# EAGLE board Alcohol_Detector_Project_Schematic (EAGLE 9.6.2), part 1 of 2
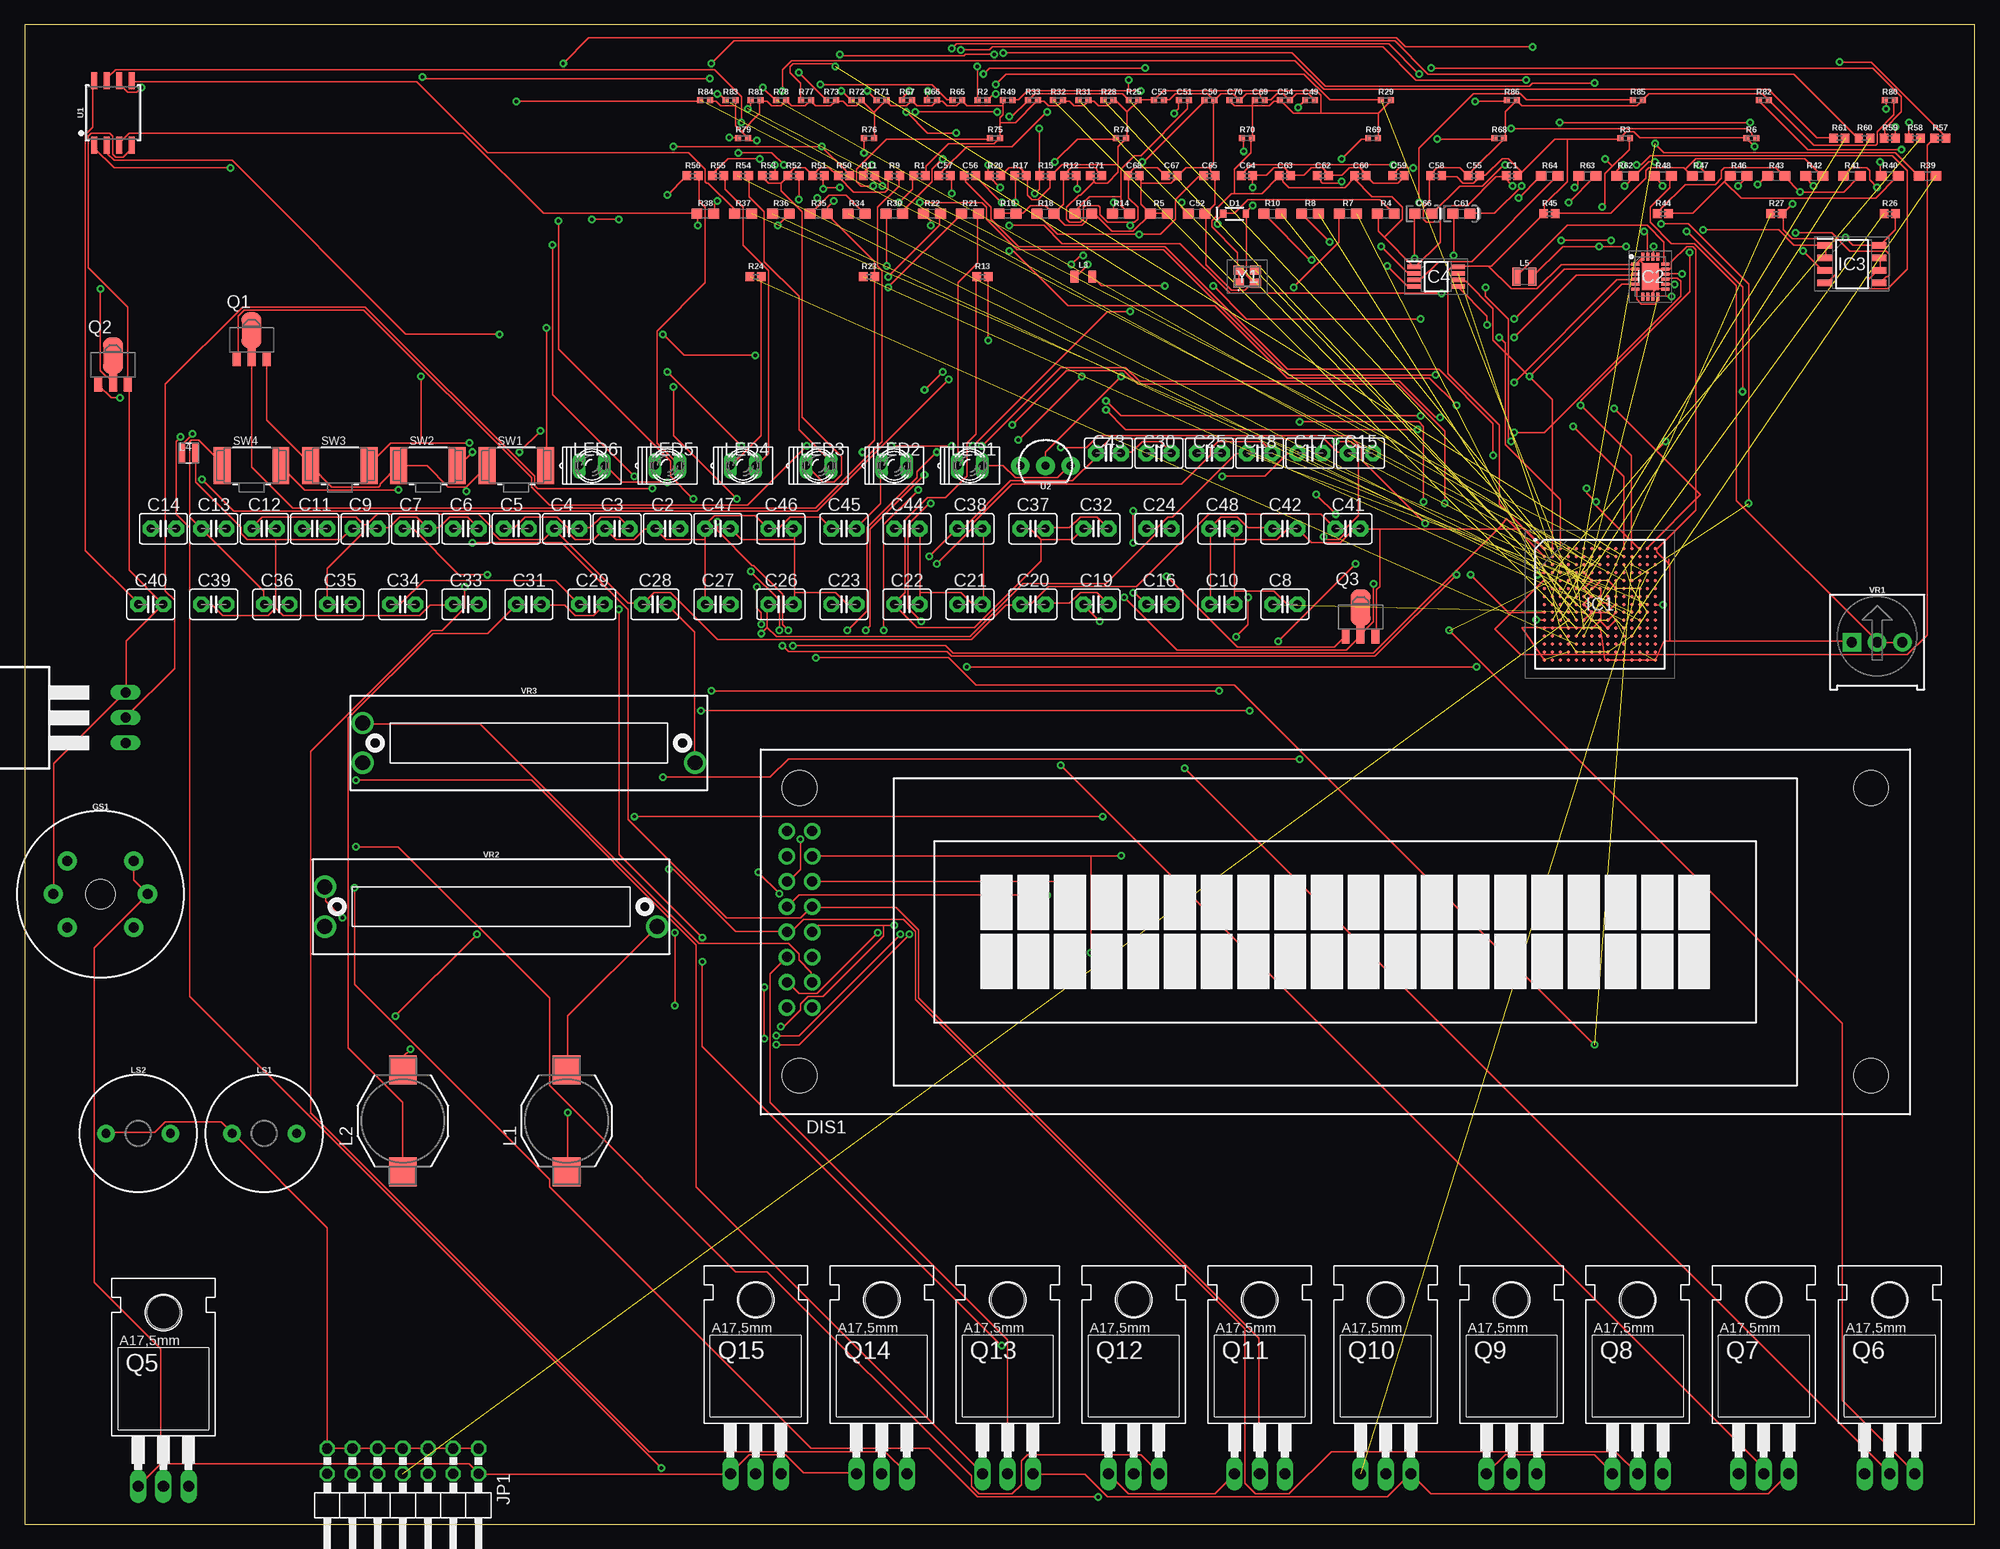
[diagram p7: board, top side]
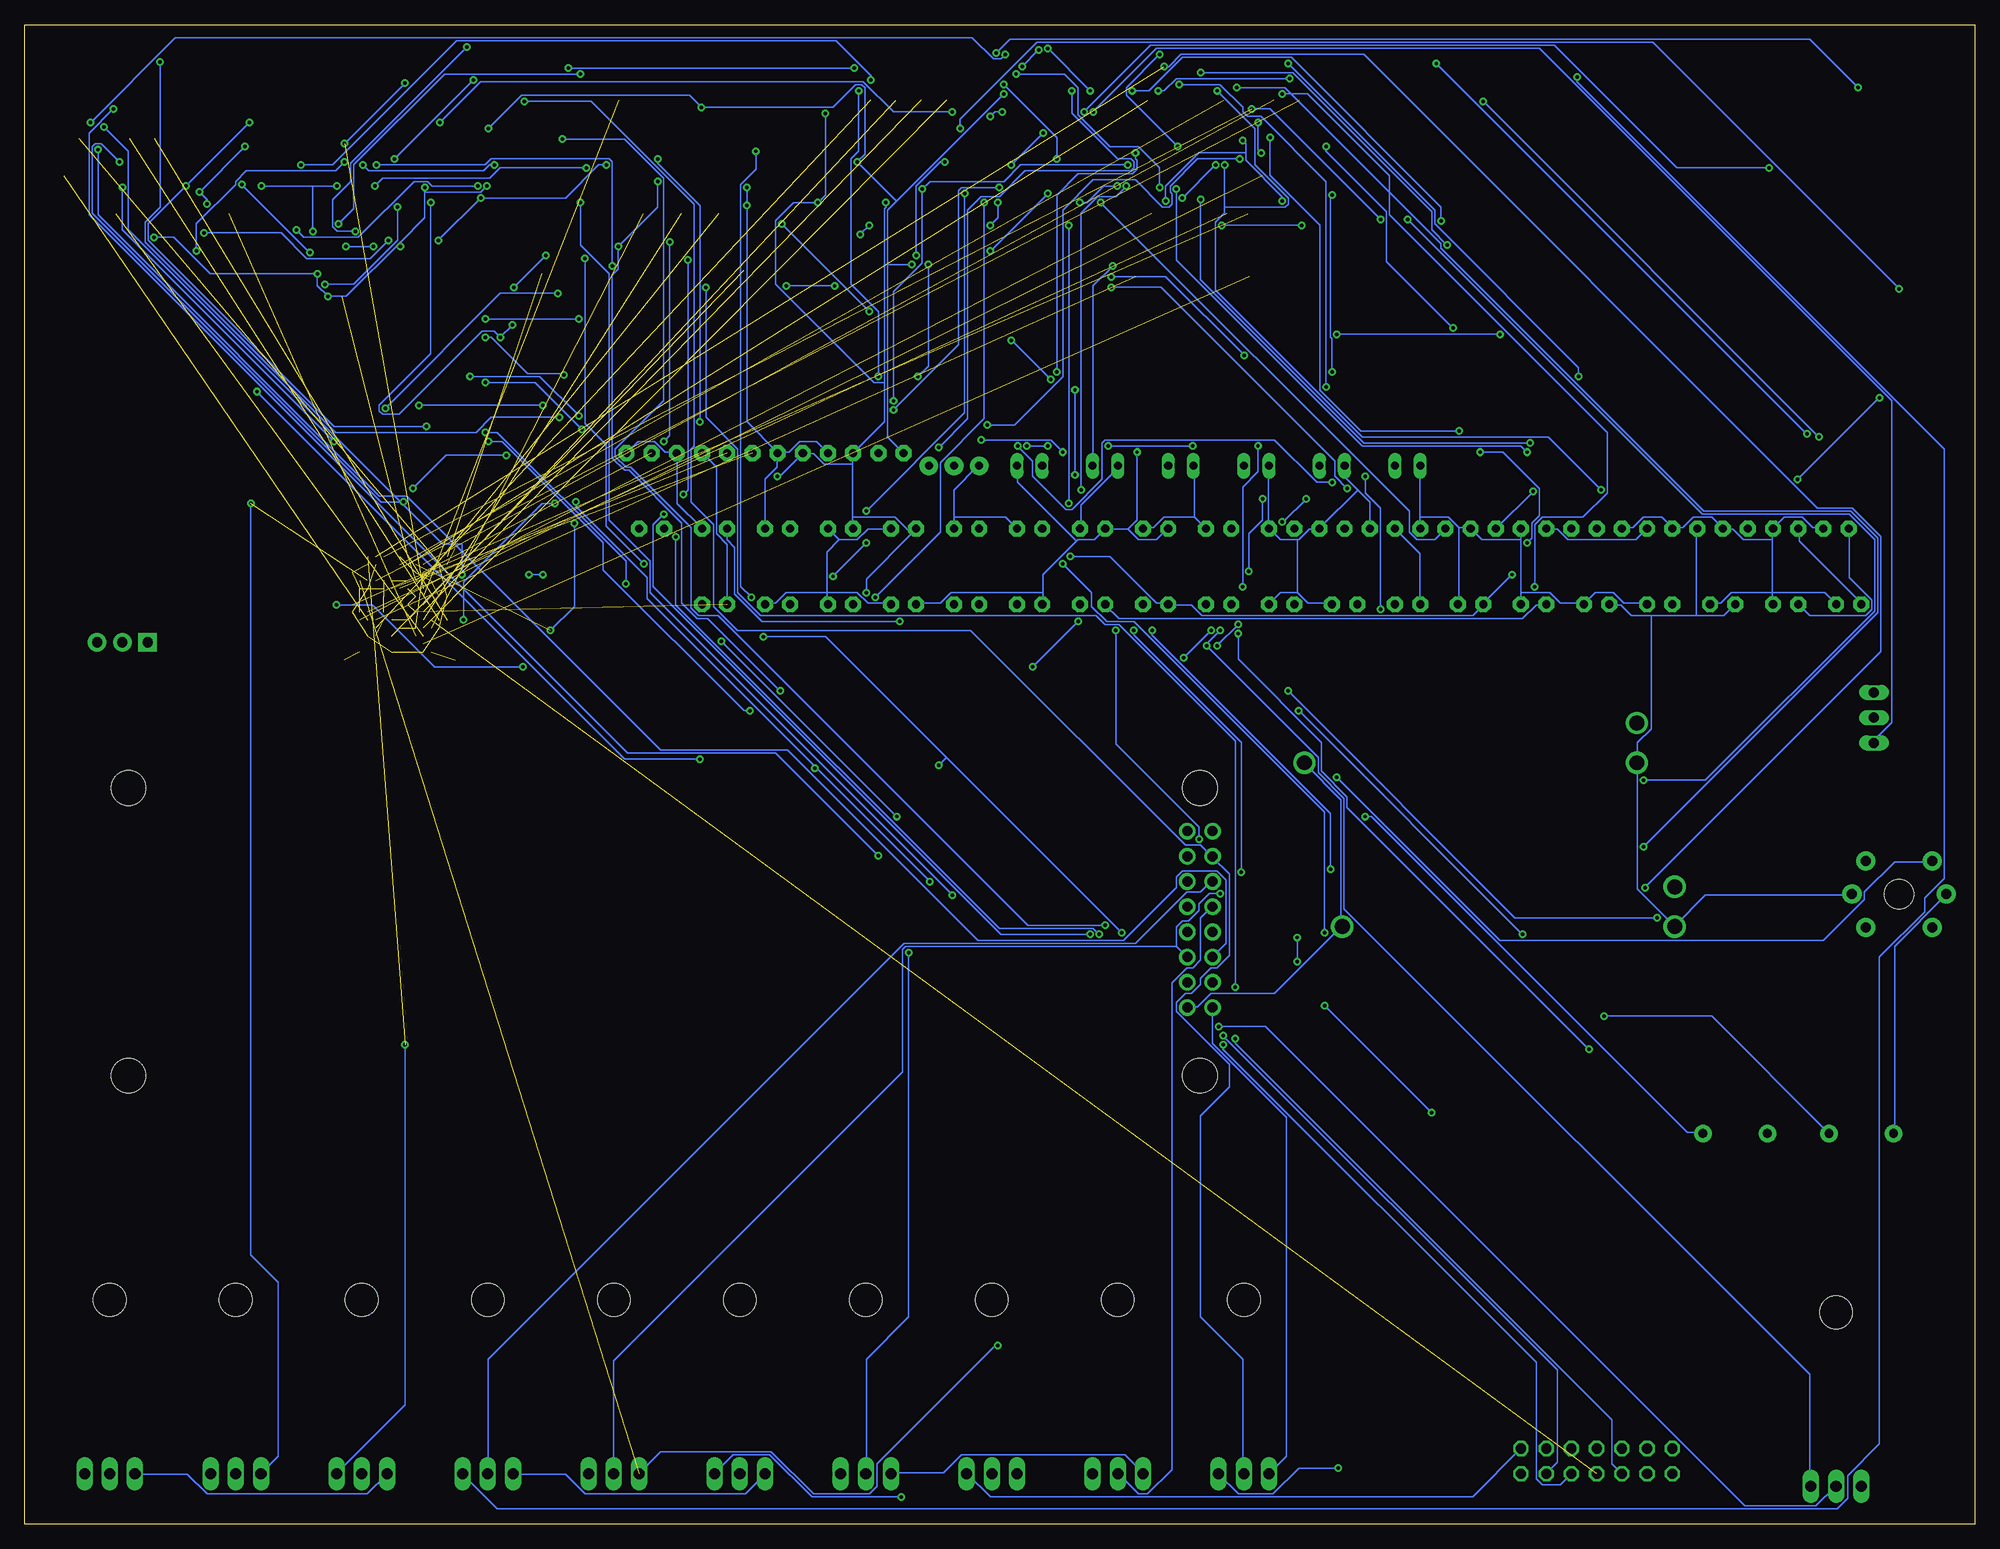
[diagram p8: board, bottom side, seen from below]

Size 196.52 x 151.12 mm. Coordinates in mm from the lower left corner, seen from the top.
Outline: 0,0 196.52,0 196.52,151.12 0,151.12 0,0
Copper layers ([6:[2:[4:[12:1+2*3+4*5+6*11+12*13+14*15+16]]]]): Top 0.035mm / dielectric 1.5mm / Route2 0.035mm / dielectric 0.15mm / Route3 0.035mm / dielectric 0.2mm / Route4 0.035mm / dielectric 0.15mm / Route5 0.035mm / dielectric 0.2mm / Route6 0.035mm / dielectric 0.15mm / Route11 0.035mm / dielectric 0.2mm / Route12 0.035mm / dielectric 0.15mm / Route13 0.035mm / dielectric 0.2mm / Route14 0.035mm / dielectric 0.15mm / Route15 0.035mm / dielectric 0.2mm / Bottom 0.035mm
Design rules "default *": minimum track width 6mil, minimum drill 0.35mm, track to track 6mil, track to pad 6mil, pad to pad 6mil, via to via 6mil, smd to smd 6mil, copper to edge 40mil, drill to drill 6mil, minimum pad ring 10mil, minimum via ring 8mil, stop-mask expansion 4mil, vias tented up to drill 0mil, thermal gap 10mil

## Footprints (pad centres in the part's own frame; a part is rotated, then mirrored left to right if it is on the bottom)
0402 = smd 0.85 x 0.9: 1 -0.58,0; 2 0.58,0
C2.5-3 = drill 0.813 pad 1.6 octagon: 1 -1.27,0; 2 1.27,0
0402-TIGHT = smd 0.6 x 0.6: 1 -0.5,0; 2 0.5,0
0603 = smd 1.1 x 1: 1 -0.85,0; 2 0.85,0
0603-POLAR = smd 1.1 x 1: + 0.85,0; - -0.85,0
SOD-323 = smd 0.63 x 0.83: A 1.15,0; C -1.15,0
TUXGR_20X2 = drill 1 pad 1.676: 1 -52.73,-7.62; 2 -55.27,-7.62; 3 -52.73,-5.08; 4 -55.27,-5.08; 5 -52.73,-2.54; 6 -55.27,-2.54; 7 -52.73,0; 8 -55.27,0; 9 -52.73,2.54; 10 -55.27,2.54; 11 -52.73,5.08; 12 -55.27,5.08; 13 -52.73,7.62; 14 -55.27,7.62; 15 -52.73,10.16; 16 -55.27,10.16 | hole 3.5: -54,-14.5; 54,-14.5; -54,14.5; 54,14.5
GAS_SENSOR = drill 1.016 pad 1.93: A1 -3.35,3.35; A2 -3.35,-3.35; B1 3.35,3.35; B2 3.35,-3.35; HA -4.75,0; HB 4.75,0 | hole 3: 0,0
BGA225C80P15X15_1300X1300X140 = smd 0.37 x 0.37: A1 -5.6,5.6; A2 -4.8,5.6; A3 -4,5.6; A4 -3.2,5.6; A5 -2.4,5.6; A6 -1.6,5.6; A7 -0.8,5.6; A8 0,5.6; A9 0.8,5.6; A10 1.6,5.6; A11 2.4,5.6; A12 3.2,5.6; A13 4,5.6; A14 4.8,5.6; A15 5.6,5.6; B1 -5.6,4.8; B2 -4.8,4.8; B3 -4,4.8; B4 -3.2,4.8; B5 -2.4,4.8; B6 -1.6,4.8; B7 -0.8,4.8; B8 0,4.8; B9 0.8,4.8; B10 1.6,4.8; B11 2.4,4.8; B12 3.2,4.8; B13 4,4.8; B14 4.8,4.8; B15 5.6,4.8; C1 -5.6,4; C2 -4.8,4; C3 -4,4; C4 -3.2,4; C5 -2.4,4; C6 -1.6,4; C7 -0.8,4; C8 0,4; C9 0.8,4; C10 1.6,4; C11 2.4,4; C12 3.2,4; C13 4,4; C14 4.8,4; C15 5.6,4; D1 -5.6,3.2; D2 -4.8,3.2; D3 -4,3.2; D4 -3.2,3.2; D5 -2.4,3.2; D6 -1.6,3.2; D7 -0.8,3.2; D8 0,3.2; D9 0.8,3.2; D10 1.6,3.2; D11 2.4,3.2; D12 3.2,3.2; D13 4,3.2; D14 4.8,3.2; D15 5.6,3.2; E1 -5.6,2.4; E2 -4.8,2.4; E3 -4,2.4; E4 -3.2,2.4; E5 -2.4,2.4; E6 -1.6,2.4; E7 -0.8,2.4; E8 0,2.4; E9 0.8,2.4; E10 1.6,2.4; E11 2.4,2.4; E12 3.2,2.4; E13 4,2.4; E14 4.8,2.4; E15 5.6,2.4; F1 -5.6,1.6; F2 -4.8,1.6; F3 -4,1.6; F4 -3.2,1.6; F5 -2.4,1.6; F6 -1.6,1.6; F7 -0.8,1.6; F8 0,1.6; F9 0.8,1.6; F10 1.6,1.6; F11 2.4,1.6; F12 3.2,1.6; F13 4,1.6; F14 4.8,1.6; F15 5.6,1.6; G1 -5.6,0.8; G2 -4.8,0.8; G3 -4,0.8; G4 -3.2,0.8; G5 -2.4,0.8; G6 -1.6,0.8; G7 -0.8,0.8; G8 0,0.8; G9 0.8,0.8; G10 1.6,0.8; G11 2.4,0.8; G12 3.2,0.8; G13 4,0.8; G14 4.8,0.8; G15 5.6,0.8; H1 -5.6,0; H2 -4.8,0; H3 -4,0; H4 -3.2,0; H5 -2.4,0; H6 -1.6,0; H7 -0.8,0; H8 0,0; H9 0.8,0; H10 1.6,0; H11 2.4,0; H12 3.2,0; H13 4,0; H14 4.8,0; H15 5.6,0; J1 -5.6,-0.8; J2 -4.8,-0.8; J3 -4,-0.8; J4 -3.2,-0.8; J5 -2.4,-0.8; J6 -1.6,-0.8; J7 -0.8,-0.8; J8 0,-0.8; J9 0.8,-0.8; J10 1.6,-0.8; J11 2.4,-0.8; J12 3.2,-0.8; J13 4,-0.8; J14 4.8,-0.8; J15 5.6,-0.8; K1 -5.6,-1.6; K2 -4.8,-1.6; K3 -4,-1.6; K4 -3.2,-1.6; K5 -2.4,-1.6; K6 -1.6,-1.6; K7 -0.8,-1.6; K8 0,-1.6; K9 0.8,-1.6; K10 1.6,-1.6; K11 2.4,-1.6; K12 3.2,-1.6; K13 4,-1.6; K14 4.8,-1.6; K15 5.6,-1.6; L1 -5.6,-2.4; L2 -4.8,-2.4; L3 -4,-2.4; L4 -3.2,-2.4; L5 -2.4,-2.4; L6 -1.6,-2.4; L7 -0.8,-2.4; L8 0,-2.4; L9 0.8,-2.4; L10 1.6,-2.4; L11 2.4,-2.4; L12 3.2,-2.4; L13 4,-2.4; L14 4.8,-2.4; L15 5.6,-2.4; M1 -5.6,-3.2; M2 -4.8,-3.2; M3 -4,-3.2; M4 -3.2,-3.2; M5 -2.4,-3.2; M6 -1.6,-3.2; M7 -0.8,-3.2; M8 0,-3.2; M9 0.8,-3.2; M10 1.6,-3.2; M11 2.4,-3.2; M12 3.2,-3.2; M13 4,-3.2; M14 4.8,-3.2; M15 5.6,-3.2; N1 -5.6,-4; N2 -4.8,-4; N3 -4,-4; N4 -3.2,-4; N5 -2.4,-4; N6 -1.6,-4; N7 -0.8,-4; N8 0,-4; N9 0.8,-4; N10 1.6,-4; N11 2.4,-4; N12 3.2,-4; N13 4,-4; N14 4.8,-4; N15 5.6,-4; P1 -5.6,-4.8; P2 -4.8,-4.8; P3 -4,-4.8; P4 -3.2,-4.8; P5 -2.4,-4.8; P6 -1.6,-4.8; P7 -0.8,-4.8; P8 0,-4.8; P9 0.8,-4.8; P10 1.6,-4.8; P11 2.4,-4.8; P12 3.2,-4.8; P13 4,-4.8; P14 4.8,-4.8; P15 5.6,-4.8; R1 -5.6,-5.6; R2 -4.8,-5.6; R3 -4,-5.6; R4 -3.2,-5.6; R5 -2.4,-5.6; R6 -1.6,-5.6; R7 -0.8,-5.6; R8 0,-5.6; R9 0.8,-5.6; R10 1.6,-5.6; R11 2.4,-5.6; R12 3.2,-5.6; R13 4,-5.6; R14 4.8,-5.6; R15 5.6,-5.6
QFN50P300X400X80-21N = smd 0.8 x 0.3: 1 -1.5,1.25; 2 -1.5,0.75; 3 -1.5,0.25; 4 -1.5,-0.25; 5 -1.5,-0.75; 6 -1.5,-1.25; 11 1.5,-1.25; 12 1.5,-0.75; 13 1.5,-0.25; 14 1.5,0.25; 15 1.5,0.75; 16 1.5,1.25 | smd 0.3 x 0.8: 7 -0.75,-2; 8 -0.25,-2; 9 0.25,-2; 10 0.75,-2; 17 0.75,2; 18 0.25,2; 19 -0.25,2; 20 -0.75,2 | smd 1.75 x 2.75: 21 0,0
SOIC127P600X175-8N = smd 1.528 x 0.65: 1 -2.711,1.905; 2 -2.711,0.635; 3 -2.711,-0.635; 4 -2.711,-1.905; 5 2.711,-1.905; 6 2.711,-0.635; 7 2.711,0.635; 8 2.711,1.905
SOP65P490X110-8N = smd 1.4 x 0.45: 1 -2.2,0.975; 2 -2.2,0.325; 3 -2.2,-0.325; 4 -2.2,-0.975; 5 2.2,-0.975; 6 2.2,-0.325; 7 2.2,0.325; 8 2.2,0.975
2X07/90 = drill 1.016 octagon: 1 -7.62,-6.35; 2 -7.62,-3.81; 3 -5.08,-6.35; 4 -5.08,-3.81; 5 -2.54,-6.35; 6 -2.54,-3.81; 7 0,-6.35; 8 0,-3.81; 9 2.54,-6.35; 10 2.54,-3.81; 11 5.08,-6.35; 12 5.08,-3.81; 13 7.62,-6.35; 14 7.62,-3.81
P0762NL = smd 2.794 x 2.921: 1 0,5.156; 2 0,-5.156
0805 = smd 0.8 x 1.2: 1 -0.9,0; 2 0.9,0
INDUCTOR_2X2 = smd 0.65 x 2: P$1 -0.675,0; P$2 0.675,0
0805-WIDE = smd 0.8 x 1.8: 1 -0.8,0; 2 0.8,0
Q62902-B152 = drill 0.813 long: A 1.27,0; K -1.27,0
BUZZER-12MM = drill 0.9 pad 1.778: + 3.25,0; - -3.25,0
SOT89 = smd 0.8 x 1.4: 1 -1.499,-1.981; 3 1.499,-1.981 | smd 0.8 x 1.9: 2 0,-1.727 | smd 2.032 x 3.65: 2@1 0,0.94
TO262-H = drill 1.016 long: 1 -2.54,-12.7; 2 0,-12.7; 3 2.54,-12.7
TO220AH = drill 1.118 long: B -2.54,-6.35; C 0,-6.35; E 2.54,-6.35 | hole 3.302: 0,11.176
BTN_CK_KSS = smd 1.7 x 3.7: P$1 -2.95,0; P$2 2.95,0
SOIC-8 = smd 0.61 x 1.702: 1 -1.905,-3.251; 2 -0.635,-3.251; 3 0.635,-3.251; 4 1.905,-3.251; 5 1.905,3.251; 6 0.635,3.251; 7 -0.635,3.251; 8 -1.905,3.251
TO-92-AMMO = drill 0.813 pad 1.88: 1 -2.54,0; 2 0,0; 3 2.54,0
TRIMPOT-PTH-3386U = drill 1.016 pad 1.88 square: 1 -2.54,-0.015 | drill 1.016 pad 1.88: 2 0,-0.015; 3 2.54,-0.015
SLIDER-SMALL = drill 1.5: BOTTOM 16.75,-2; TOP -16.75,-2; WIPER -16.75,2
SG210STF120000ML3 = smd 1.1 x 0.9: 1 -0.85,-0.65; 2 0.85,-0.65; 3 0.85,0.65; 4 -0.85,0.65

## Placement (x,y rotation side)
C1  0.1uF  [0402]  149.86,135.89 0 top
C2  47nf  [C2.5-3]  64.77,100.33 0 top
C3  47nf  [C2.5-3]  59.69,100.33 0 top
C4  47nf  [C2.5-3]  54.61,100.33 0 top
C5  47nf  [C2.5-3]  49.53,100.33 0 top
C6  47nf  [C2.5-3]  44.45,100.33 0 top
C7  47nf  [C2.5-3]  39.37,100.33 0 top
C8  470nf  [C2.5-3]  127,92.71 0 top
C9  47nf  [C2.5-3]  34.29,100.33 0 top
C10  470nf  [C2.5-3]  120.65,92.71 0 top
C11  47nf  [C2.5-3]  29.21,100.33 0 top
C12  47nf  [C2.5-3]  24.13,100.33 0 top
C13  47nf  [C2.5-3]  19.05,100.33 0 top
C14  47nf  [C2.5-3]  13.97,100.33 0 top
C15  47nf  [C2.5-3]  134.62,107.95 0 top
C16  470nf  [C2.5-3]  114.3,92.71 0 top
C17  47nf  [C2.5-3]  129.54,107.95 0 top
C18  10nf  [C2.5-3]  124.46,107.95 0 top
C19  470nf  [C2.5-3]  107.95,92.71 0 top
C20  470nf  [C2.5-3]  101.6,92.71 0 top
C21  470nf  [C2.5-3]  95.25,92.71 0 top
C22  470nf  [C2.5-3]  88.9,92.71 0 top
C23  470nf  [C2.5-3]  82.55,92.71 0 top
C24  4.7uf  [C2.5-3]  114.3,100.33 0 top
C25  47nf  [C2.5-3]  119.38,107.95 0 top
C26  470nf  [C2.5-3]  76.2,92.71 0 top
C27  470nf  [C2.5-3]  69.85,92.71 0 top
C28  470nf  [C2.5-3]  63.5,92.71 0 top
C29  470nf  [C2.5-3]  57.15,92.71 0 top
C30  47uf  [C2.5-3]  114.3,107.95 0 top
C31  470nf  [C2.5-3]  50.8,92.71 0 top
C32  4.7uf  [C2.5-3]  107.95,100.33 0 top
C33  470nf  [C2.5-3]  44.45,92.71 0 top
C34  470nf  [C2.5-3]  38.1,92.71 0 top
C35  470nf  [C2.5-3]  31.75,92.71 0 top
C36  470nf  [C2.5-3]  25.4,92.71 0 top
C37  4.7uf  [C2.5-3]  101.6,100.33 0 top
C38  4.7uf  [C2.5-3]  95.25,100.33 0 top
C39  100uf  [C2.5-3]  19.05,92.71 0 top
C40  470nf  [C2.5-3]  12.7,92.71 0 top
C41  470nf  [C2.5-3]  133.35,100.33 0 top
C42  470nf  [C2.5-3]  127,100.33 0 top
C43  47uf  [C2.5-3]  109.22,107.95 0 top
C44  4.7uf  [C2.5-3]  88.9,100.33 0 top
C45  4.7uf  [C2.5-3]  82.55,100.33 0 top
C46  4.7uf  [C2.5-3]  76.2,100.33 0 top
C47  4.7uf  [C2.5-3]  69.85,100.33 0 top
C48  100uf  [C2.5-3]  120.65,100.33 0 top
C49  10uF  [0402-TIGHT]  129.54,143.51 0 top
C50  20pF  [0402-TIGHT]  119.38,143.51 0 top
C51  20pF  [0402-TIGHT]  116.84,143.51 0 top
C52  22uF  [0603]  118.11,132.08 0 top
C53  20pF  [0402-TIGHT]  114.3,143.51 0 top
C54  10uF  [0402-TIGHT]  127,143.51 0 top
C55  0.1uF  [0402]  146.05,135.89 0 top
C56  1nF  [0402]  95.25,135.89 0 top
C57  1nF  [0402]  92.71,135.89 0 top
C58  1.0uF  [0402]  142.24,135.89 0 top
C59  0.1uF  [0402]  138.43,135.89 0 top
C60  0.1uF  [0402]  134.62,135.89 0 top
C61  10uF  [0603-POLAR]  144.78,132.08 0 top
C62  1.0uF  [0402]  130.81,135.89 0 top
C63  1.0uF  [0402]  127,135.89 0 top
C64  0.1uF  [0402]  123.19,135.89 0 top
C65  0.1uF  [0402]  119.38,135.89 0 top
C66  10uF  [0603-POLAR]  140.97,132.08 0 top
C67  0.1uF  [0402]  115.57,135.89 0 top
C68  0.1uF  [0402]  111.76,135.89 0 top
C69  10uF  [0402-TIGHT]  124.46,143.51 0 top
C70  10uF  [0402-TIGHT]  121.92,143.51 0 top
C71  1.0uF  [0402]  107.95,135.89 0 top
D1  3.6V  [SOD-323]  121.92,132.08 0 top
DIS1  TUXGR_20X2  [TUXGR_20X2]  132.08,59.69 0 top
GS1  GAS_SENSORMQ-3  [GAS_SENSOR]  7.62,63.5 0 top
IC1  XC7S25-1CSGA225I  [BGA225C80P15X15_1300X1300X140]  158.75,92.71 0 top
IC2  LTC3569EUDC#TRPBF  [QFN50P300X400X80-21N]  163.83,125.73 0 top
IC3  LMP7702MAX_NOPB  [SOIC127P600X175-8N]  184.15,127 0 top
IC4  DAC8532IDGKR  [SOP65P490X110-8N]  142.24,125.73 0 top
JP1  [2X07/90]  38.1,1.27 180 top
L1  P0762.154NL  [P0762NL]  54.61,40.64 0 top
L2  P0762.154NL  [P0762NL]  38.1,40.64 0 top
L3  3.3µH/±20%/450mA  [0805]  106.68,125.73 0 top
L4  1.5uH  [INDUCTOR_2X2]  16.51,107.95 0 top
L5  2.2uH  [0805-WIDE]  151.13,125.73 0 top
LED1  [Q62902-B152]  95.25,106.68 0 top
LED2  [Q62902-B152]  87.63,106.68 0 top
LED3  [Q62902-B152]  80.01,106.68 0 top
LED4  [Q62902-B152]  72.39,106.68 0 top
LED5  [Q62902-B152]  64.77,106.68 0 top
LED6  [Q62902-B152]  57.15,106.68 0 top
LS1  BUZZER-PTH  [BUZZER-12MM]  24.13,39.37 0 top
LS2  BUZZER-PTH  [BUZZER-12MM]  11.43,39.37 0 top
Q1  PNP-TRANSISTIOR-2COLSOT89  [SOT89]  22.86,119.38 0 top
Q2  [SOT89]  8.89,116.84 0 top
Q3  [SOT89]  134.62,91.44 0 top
Q4  IRF3704L  [TO262-H]  -2.54,81.28 90 top
Q5  IRF3704  [TO220AH]  13.97,10.16 0 top
Q6  IRF3704  [TO220AH]  187.96,11.43 0 top
Q7  IRF3704  [TO220AH]  175.26,11.43 0 top
Q8  IRF3704  [TO220AH]  162.56,11.43 0 top
Q9  IRF3704  [TO220AH]  149.86,11.43 0 top
Q10  IRF3704  [TO220AH]  137.16,11.43 0 top
Q11  IRF3704  [TO220AH]  124.46,11.43 0 top
Q12  IRF3704  [TO220AH]  111.76,11.43 0 top
Q13  IRF3704  [TO220AH]  99.06,11.43 0 top
Q14  IRF3704  [TO220AH]  86.36,11.43 0 top
Q15  IRF3704  [TO220AH]  73.66,11.43 0 top
R1  0  [0402]  90.17,135.89 0 top
R2  10k  [0402-TIGHT]  96.52,143.51 0 top
R3  3.3KOHM-0402T-1/16W-1%  [0402-TIGHT]  161.29,139.7 0 top
R4  120OHM  [0603]  137.16,132.08 0 top
R5  124k  [0603]  114.3,132.08 0 top
R6  150KOHM-0402T-1/16W-1%  [0402-TIGHT]  173.99,139.7 0 top
R7  120OHM  [0603]  133.35,132.08 0 top
R8  120OHM  [0603]  129.54,132.08 0 top
R9  22Ω  [0402]  87.63,135.89 0 top
R10  120OHM  [0603]  125.73,132.08 0 top
R11  0  [0402]  85.09,135.89 0 top
R12  100K  [0402]  105.41,135.89 0 top
R13  1KOHM-0402-1/16W-1%  [0402]  96.52,125.73 0 top
R14  30.1k  [0603]  110.49,132.08 0 top
R15  100K  [0402]  102.87,135.89 0 top
R16  124k  [0603]  106.68,132.08 0 top
R17  100K  [0402]  100.33,135.89 0 top
R18  180k  [0603]  102.87,132.08 0 top
R19  57.6k  [0603]  99.06,132.08 0 top
R20  100K  [0402]  97.79,135.89 0 top
R21  680  [0603]  95.25,132.08 0 top
R22  100  [0603]  91.44,132.08 0 top
R23  1KOHM-0402-1/16W-1%  [0402]  85.09,125.73 0 top
R24  1KOHM-0402-1/16W-1%  [0402]  73.66,125.73 0 top
R25  4.7k  [0402-TIGHT]  111.76,143.51 0 top
R26  1KOHM-0402-1/16W-1%  [0402]  187.96,132.08 0 top
R27  1KOHM-0402-1/16W-1%  [0402]  176.53,132.08 0 top
R28  4.7k  [0402-TIGHT]  109.22,143.51 0 top
R29  200OHM-0402T-1/16W-1%  [0402-TIGHT]  137.16,143.51 0 top
R30  100  [0603]  87.63,132.08 0 top
R31  4.7k  [0402-TIGHT]  106.68,143.51 0 top
R32  4.7k  [0402-TIGHT]  104.14,143.51 0 top
R33  4.7k  [0402-TIGHT]  101.6,143.51 0 top
R34  100  [0603]  83.82,132.08 0 top
R35  1.8k  [0603]  80.01,132.08 0 top
R36  100  [0603]  76.2,132.08 0 top
R37  100  [0603]  72.39,132.08 0 top
R38  1.8k  [0603]  68.58,132.08 0 top
R39  47  [0603]  191.77,135.89 0 top
R40  150  [0603]  187.96,135.89 0 top
R41  866  [0603]  184.15,135.89 0 top
R42  150  [0603]  180.34,135.89 0 top
R43  866  [0603]  176.53,135.89 0 top
R44  1KOHM-0402-1/16W-1%  [0402]  165.1,132.08 0 top
R45  1KOHM-0402-1/16W-1%  [0402]  153.67,132.08 0 top
R46  2.2  [0603]  172.72,135.89 0 top
R47  2.2  [0603]  168.91,135.89 0 top
R48  47  [0603]  165.1,135.89 0 top
R49  4.7k  [0402-TIGHT]  99.06,143.51 0 top
R50  10k  [0402]  82.55,135.89 0 top
R51  10k  [0402]  80.01,135.89 0 top
R52  10k  [0402]  77.47,135.89 0 top
R53  10k  [0402]  74.93,135.89 0 top
R54  330  [0402]  72.39,135.89 0 top
R55  330  [0402]  69.85,135.89 0 top
R56  330  [0402]  67.31,135.89 0 top
R57  330  [0402]  193.04,139.7 0 top
R58  10k  [0402]  190.5,139.7 0 top
R59  10k  [0402]  187.96,139.7 0 top
R60  10k  [0402]  185.42,139.7 0 top
R61  10k  [0402]  182.88,139.7 0 top
R62  150  [0603]  161.29,135.89 0 top
R63  100  [0603]  157.48,135.89 0 top
R64  150  [0603]  153.67,135.89 0 top
R65  22k  [0402-TIGHT]  93.98,143.51 0 top
R66  22k  [0402-TIGHT]  91.44,143.51 0 top
R67  33k  [0402-TIGHT]  88.9,143.51 0 top
R68  3.3KOHM-0402T-1/16W-1%  [0402-TIGHT]  148.59,139.7 0 top
R69  3.3KOHM-0402T-1/16W-1%  [0402-TIGHT]  135.89,139.7 0 top
R70  3.3KOHM-0402T-1/16W-1%  [0402-TIGHT]  123.19,139.7 0 top
R71  22k  [0402-TIGHT]  86.36,143.51 0 top
R72  22k  [0402-TIGHT]  83.82,143.51 0 top
R73  33k  [0402-TIGHT]  81.28,143.51 0 top
R74  3.3KOHM-0402T-1/16W-1%  [0402-TIGHT]  110.49,139.7 0 top
R75  3.3KOHM-0402T-1/16W-1%  [0402-TIGHT]  97.79,139.7 0 top
R76  3.3KOHM-0402T-1/16W-1%  [0402-TIGHT]  85.09,139.7 0 top
R77  22k  [0402-TIGHT]  78.74,143.51 0 top
R78  22k  [0402-TIGHT]  76.2,143.51 0 top
R79  3.3KOHM-0402T-1/16W-1%  [0402-TIGHT]  72.39,139.7 0 top
R80  3.3KOHM-0402T-1/16W-1%  [0402-TIGHT]  187.96,143.51 0 top
R81  33k  [0402-TIGHT]  73.66,143.51 0 top
R82  3.3KOHM-0402T-1/16W-1%  [0402-TIGHT]  175.26,143.51 0 top
R83  22k  [0402-TIGHT]  71.12,143.51 0 top
R84  22k  [0402-TIGHT]  68.58,143.51 0 top
R85  3.3KOHM-0402T-1/16W-1%  [0402-TIGHT]  162.56,143.51 0 top
R86  3.3KOHM-0402T-1/16W-1%  [0402-TIGHT]  149.86,143.51 0 top
SW1  [BTN_CK_KSS]  49.53,106.68 0 top
SW2  [BTN_CK_KSS]  40.64,106.68 0 top
SW3  [BTN_CK_KSS]  31.75,106.68 0 top
SW4  [BTN_CK_KSS]  22.86,106.68 0 top
U1  W25Q32FV  [SOIC-8]  8.89,142.24 0 top
U2  DS18B20  [TO-92-AMMO]  102.87,106.68 0 top
VR1  10k  [TRIMPOT-PTH-3386U]  186.69,88.9 0 top
VR2  10k  [SLIDER-SMALL]  46.99,62.23 0 top
VR3  10k  [SLIDER-SMALL]  50.8,78.74 0 top
Y1  SG-210STF_12.0000ML3  [SG210STF120000ML3]  123.19,125.73 0 top

## Tracks (layer width: path | path; a pad name or v marks a point on that pad's centre or on a via)
A2
  Top 0.152: IC1.A2 153.97,98.45 153.97,113.33 147.98,119.33 147.98,122.53 145.24,125.27 144.47,125.27 IC4.6
A3  (via drill 0.35)
  Top 0.152: v148.59,119.63 149.2,119.02 149.2,108.81 154.74,103.28 154.74,98.45 IC1.A3 | v147.37,120.85 147.37,121.77 144.47,124.66 IC4.5 | v155.6,133.2 158.19,135.79 R63.2
  Bottom 0.152: v147.37,120.85 v148.59,119.63 149.2,120.24 150.42,120.24 158.8,111.86 160.48,111.86 160.78,112.17 160.78,112.78 155.6,117.96 v155.6,133.2
A11  (via drill 0.35)
  Top 0.152: v156.06,110.64 161.14,105.56 161.14,98.45 IC1.A11 | v180.29,134.87 179.38,135.79 R42.1 | v103.02,142.34 99.52,138.84 94.94,138.84 92.51,136.4 92.51,136.25 92.2,135.94 C57.1 | v173.89,141.28 v154.69,141.28
  Bottom 0.152: v156.06,110.64 165.35,110.64 184.1,129.39 184.1,131.06 v180.29,134.87 v173.89,141.28 | v103.02,142.34 108.97,142.34 112.01,145.39 150.57,145.39 v154.69,141.28
A12  (via drill 0.35)
  Top 0.152: v167.79,128.17 167.79,124.21 156.82,113.23 v156.82,112.78 161.9,107.7 161.9,98.45 IC1.A12 | v174.65,135.03 175.56,135.94 R43.1 | v93.42,134.11 93.42,135.79 C57.2 | v99.21,128.32 99.67,128.32 105.16,122.83 119.94,122.83 127.25,115.52 141.58,115.52 v144.32,112.78
  Bottom 0.152: v174.65,135.03 v167.79,128.17 | v99.21,128.32 v93.42,134.11 | v156.82,112.78 v144.32,112.78
A13  (via drill 0.35)
  Top 0.152: v187,137.31 187,135.94 R40.1 | IC1.A13 162.81,98.17 158.34,102.64 v158.34,103.02 157.43,103.94 v157.43,104.39 | v147.98,107.75 147.98,110.95 142.49,116.43 127.25,116.43 114.91,128.78 100.13,128.78 97.38,131.52 97.38,132.74 94.79,135.33 94.79,135.79 C56.1
  Bottom 0.152: v158.34,103.02 160.63,103.02 189.74,132.13 189.74,138.84 189.43,139.14 188.82,139.14 v187,137.31 | v147.98,107.75 154.08,107.75 v157.43,104.39
A14  (via drill 0.35)
  Top 0.152: v165.35,109.12 164.44,108.2 | v186.69,134.72 185.93,135.48 185.93,136.4 185.62,136.7 184.1,136.7 183.34,135.94 R41.1 | IC1.A14 163.58,98.45 168.88,103.76 164.44,108.2 | v98.45,133.2 95.86,135.79 C56.2 | v99.21,130.91 102.72,130.91 104.55,129.08 116.43,129.08 121.46,124.05 v142.8,124.05 | 164.44,108.2 v160.17,112.47
  Bottom 0.152: v165.35,109.12 186.69,130.45 v186.69,134.72 | v98.45,133.2 98.45,131.67 v99.21,130.91 | v142.8,124.05 148.59,124.05 v160.17,112.47
B1  (via drill 0.35)
  Top 0.152: v77.42,88.54 92.81,88.54 93.57,87.78 135.94,87.78 148.76,100.61 149.3,101.36 IC1.B1 | v80.16,145.09 91.44,145.09 92.96,143.56 93.42,143.56 R65.1 | v65.38,114.61 65.38,109.73 v71.78,103.33 | v73.15,96.01 76.05,93.12 v76.05,90.07
  Bottom 0.152: Q5.E 16.61,3.81 16.61,15.09 63.55,62.03 63.55,73.15 66.14,75.74 66.14,77.27 v77.42,88.54 77.42,88.7 v76.05,90.07 | v80.16,145.09 76.05,145.09 73.76,142.8 73.76,142.34 73.3,141.88 71.93,141.88 65.38,135.33 v65.38,114.61 | v71.78,103.33 71.78,101.19 73.15,99.82 v73.15,96.01
B2  (1 unrouted)
B10  (via drill 0.35)  (1 unrouted)
  Top 0.152: v72.85,142.65 73.15,142.95 73.15,143.41 R81.1 | v57.15,131.52 v59.89,131.52 | v33.38,74.98 51.05,74.98 67.67,58.37 67.67,33.98 96.47,5.18 Q13.B
  Bottom 0.152: v72.85,142.65 71.02,142.65 v59.89,131.52 | v57.15,131.52 27.43,101.8 12.65,101.8 10.06,99.21 10.06,92.05 27.13,74.98 v33.38,74.98
B11  (via drill 0.35)  (1 unrouted)
  Top 0.152: v81.69,146.91 81.38,147.22 77.42,147.22 77.11,146.91 77.11,146.3 78.18,145.24 78.18,143.56 R77.1 | v33.22,64.16 33.22,54.41 52.88,34.75 52.88,33.98 79.25,7.62 91.14,7.62 96.01,2.74 v108.2,2.74
  Bottom 0.152: v81.69,146.91 81.23,146.91 80.01,148.13 61.57,148.13 15.85,102.41 12.34,102.41 9.45,99.52 9.45,87.94 v33.22,64.16 | v108.2,2.74 117.2,2.74 121.46,7.01 125.12,7.01 126.95,5.18 Q11.E
B12  (via drill 0.35)  (1 unrouted)
  Top 0.152: v84.89,144.47 85.8,143.56 R71.1 | v53.8,131.37 53.8,118.42 65.08,107.14 65.08,105.61 v67.36,103.33 | v69.8,101.04 69.8,100.13 73.3,96.62 73.46,96.62 76.35,93.73 76.35,90.68 v76.96,90.07 | v79.7,87.33 93.12,87.33 95.86,84.58 121.92,84.58 v158.19,48.31
  Bottom 0.152: v84.89,144.47 83.21,144.47 79.86,147.83 68.89,147.83 53.8,132.74 v53.8,131.37 | v67.36,103.33 69.65,101.04 v69.8,101.04 | v79.7,87.33 v76.96,90.07 | v158.19,48.31 158.19,12.04 165.05,5.18 Q8.E
C5  (via drill 0.35)  (1 unrouted)
  Top 0.152: v69.8,144.17 69.95,144.17 70.56,143.56 R83.1 | v44.35,94.49 44.35,92.35 42.06,90.07 41,90.07 28.8,77.88 28.8,41.45 62.94,7.32 86.72,7.32 88.85,5.18 Q14.E
  Bottom 0.152: v69.8,144.17 67.26,144.17 58.98,135.89 58.98,131.98 37.03,110.03 37.03,103.94 39.47,101.5 43.59,101.5 44.35,100.74 v44.35,94.49
C6  (via drill 0.35)  (1 unrouted)
  Top 0.152: v90.98,144.47 90.98,143.56 R66.1 | v104.39,108.51 106.98,108.51 108.2,109.73 133.5,109.73 134.72,108.51 134.72,107.29 v141.12,100.89 | v143.56,90.07 183.19,50.44 183.19,12.5 190.5,5.18 Q6.E
  Bottom 0.152: v90.98,144.47 90.98,142.19 86.41,137.62 85.04,137.62 84.73,137.31 84.73,136.7 85.04,136.4 95.71,136.4 98.3,133.81 100.13,133.81 101.5,132.44 101.5,111.4 v104.39,108.51 | v141.12,100.89 141.12,92.51 v143.56,90.07
C7  (via drill 0.35)  (1 unrouted)
  Top 0.152: v82.3,144.47 83.21,143.56 R72.1 | v69.04,145.69 40.23,145.69 v40.08,145.85
  Bottom 0.152: v82.3,144.47 81.69,144.47 80.47,145.69 v69.04,145.69 | v40.08,145.85 40.08,145.39 3.05,108.36 3.05,65.08 5.03,63.09 5.03,61.72 9.6,57.15 9.6,8.08 12.8,4.88 12.8,2.59 13.87,1.52 148.9,1.52 152.4,5.03 Q9.E
C8  (via drill 0.35)  (1 unrouted)
  Top 0.152: v74.37,144.78 75.59,143.56 R78.1 | v33.38,68.28 37.64,68.28 52.88,53.03 52.88,44.2 71.63,25.45 74.83,25.45 95.4,4.88 95.4,3.81 96.16,3.05 99.52,3.05 100.43,3.96 100.43,6.4 101.04,7.01 112.47,7.01 114.3,5.18 Q12.E
  Bottom 0.152: v74.37,144.78 69.49,144.78 53.8,129.08 53.8,128.63 27.28,102.11 12.5,102.11 9.75,99.36 9.75,91.9 v33.38,68.28
D1  (via drill 0.35)
  Top 0.152: v152.45,95.71 152.6,95.86 153.06,95.86 IC1.D1 | v188.52,140.82 188.52,139.75 R59.2
  Bottom 0.152: v152.45,95.71 152.45,98.8 154.43,98.8 186.08,130.45 186.08,138.38 v188.52,140.82
D2  (1 unrouted)
DAC_O1  (via drill 0.35)
  Top 0.152: v161.09,137.01 160.48,136.4 160.48,135.94 R62.1 | v137.31,126.8 139.29,124.82 139.9,124.82 IC4.4
  Bottom 0.152: v161.09,137.01 150.11,137.01 149.5,137.62 137.62,137.62 137.31,137.31 v137.31,126.8
DAC_O2
  Top 0.152: R64.2 154.38,135.79 145.85,127.25 142.49,127.25 140.66,125.42 140.06,125.42 IC4.3
DL0  (via drill 0.35)
  Top 0.152: v142.34,139.6 147.98,139.6 R68.1 | 86.56,60.35 80.01,60.35 79.4,59.74 DIS1.7 | 86.56,60.35 v87.63,60.35 | v76.2,50.14 76.5,50.14 78.18,51.82 78.18,52.43 78.94,53.19 80.47,53.19 86.56,59.28 86.56,60.35
  Bottom 0.152: v142.34,139.6 136.09,139.6 132.13,135.64 132.13,113.23 137.01,108.36 137.01,107.59 135.94,106.53 135.48,106.53 129.39,100.43 129.39,92.35 128.63,91.59 126.64,91.59 95.4,60.35 v87.63,60.35 | v76.2,50.14 71.48,50.14 23.16,1.83 16,1.83 14.02,3.81 Q5.C
DL1  (via drill 0.35)
  Top 0.152: v103.78,137.31 106.07,139.6 109.88,139.6 R74.1 | v106.68,127.86 106.38,127.86 v105.46,126.95 | v100.13,109.27 v106.53,115.67 | v91.9,108.05 89.92,106.07 89.92,105.46 84.89,100.43 84.89,92.05 v82.91,90.07 | v64.92,65.99 65.38,65.99 71.63,59.74 76.81,59.74 DIS1.8 76.96,59.74 77.27,59.74 78.49,60.96 88.54,60.96 89.76,59.74 89.76,52.88 122.99,19.66 122.99,4.12 124.05,3.05 127.41,3.05 131.67,7.32 160.32,7.32 Q8.C
  Bottom 0.152: v103.78,137.31 104.24,137.31 106.68,134.87 v106.68,127.86 | v105.46,126.95 105.46,116.74 v106.53,115.67 | v100.13,109.27 93.12,109.27 v91.9,108.05 | v82.91,90.07 82.91,89.61 64.92,71.63 v64.92,65.99
DL2  (via drill 0.35)
  Top 0.152: v71.02,139.75 71.78,139.75 R79.1 | v49.84,108.05 v51.97,110.19 | v45.11,98.91 54.1,98.91 60.81,92.2 60.81,71.02 70.71,61.11 78.18,61.11 79.25,62.18 DIS1.9 79.4,62.18 87.78,62.18 90.07,59.89 90.07,53.03 124.36,18.75 124.36,5.18 Q11.C
  Bottom 0.152: v71.02,139.75 71.02,135.94 65.99,130.91 65.99,114.3 61.87,110.19 v51.97,110.19 | v49.84,108.05 47.55,108.05 43.89,104.39 43.89,101.65 44.65,100.89 44.65,99.36 v45.11,98.91
DL3  (via drill 0.35)
  Top 0.152: v140.51,133.2 140.51,138.68 146,144.17 150.72,144.17 151.33,143.56 162,143.56 R85.1 | v103.02,63.4 78.03,63.4 76.96,62.33 DIS1.10
  Bottom 0.152: v140.51,133.2 140.51,128.93 137.62,126.03 137.62,101.19 133.5,97.08 133.5,93.88 v103.02,63.4 | Q14.C 86.26,5.03 84.28,3.05 83.36,3.05 80.92,5.49 80.92,54.56 79.4,56.08 78.79,56.08 78.03,56.84 78.03,61.11 76.96,62.18 DIS1.10
DL4  (via drill 0.35)
  Top 0.152: v132.74,137.62 134.72,139.6 135.33,139.6 R69.1 | v128.47,111.1 140.51,111.1 140.97,110.64 v140.97,103.02 | DIS1.11 v105.31,64.77 | v116.89,76.2 187.91,5.18 Q6.C
  Bottom 0.152: v132.74,137.62 132.74,137.16 128.47,132.89 v128.47,111.1 | v140.97,103.02 140.97,102.56 133.81,95.4 133.81,93.27 116.74,76.2 | v105.31,64.77 116.74,76.2 | 116.74,76.2 v116.89,76.2
DL5  (via drill 0.35)
  Top 0.152: v85.5,134.87 84.28,134.87 83.82,135.33 83.82,136.55 86.87,139.6 97.23,139.6 R75.1 | v90.07,104.24 86.56,100.74 v86.56,90.07 | v78.18,69.04 78.18,65.99 76.96,64.77 DIS1.12
  Bottom 0.152: v85.5,134.87 86.56,133.81 88.39,133.81 90.07,132.13 v90.07,104.24 | v86.56,90.07 86.56,78.64 78.18,70.26 v78.18,69.04 | Q9.C 149.81,5.18 149.81,16.61 107.9,58.52 84.58,58.52 79.4,63.7 78.03,63.7 76.96,64.77 DIS1.12
DL6  (via drill 0.35)
  Top 0.152: v187.6,142.65 187.6,143.41 R80.1 | 107.44,67.36 79.4,67.36 DIS1.13 | 107.44,67.36 v110.49,67.36 | 107.44,67.36 v107.44,57.61
  Bottom 0.152: v187.6,142.65 190.04,140.21 190.04,131.98 135.79,77.72 120.85,77.72 v110.49,67.36 | v107.44,57.61 107.44,20.88 111.71,16.61 111.71,5.18 Q12.C
DL7  (via drill 0.35)
  Top 0.152: v146.15,143.41 149.35,143.41 R86.1
  Bottom 0.152: v146.15,143.41 139.45,143.41 129.08,133.04 129.08,108.66 129.39,108.36 129.39,103.02 127.1,100.74 127.1,92.51 124.66,90.07 101.19,90.07 79.55,68.43 78.03,68.43 76.96,67.36 DIS1.14 76.81,67.21 75.13,65.53 75.13,57.3 76.35,56.08 76.96,56.08 78.03,55.02 78.03,54.41 78.94,53.49 79.55,53.49 80.47,52.58 80.47,51.66 75.13,46.33 75.13,44.04 78.03,41.15 78.03,20.88 73.76,16.61 73.76,5.18 Q15.C
E  (via drill 0.35)
  Top 0.152: v189.13,138.53 179.68,138.53 174.8,143.41 R82.1 | Q13.C 99.06,18.59 75.13,42.52 75.13,55.47 DIS1.6 | DIS1.6
  Bottom 0.152: v189.13,138.53 189.13,131.98 160.78,103.63 158.04,103.63 132.44,78.03 119.63,78.03 100.43,58.83 85.8,58.83 80.47,64.16 80.47,65.23 79.86,65.84 76.35,65.84 75.44,64.92 75.44,58.52 DIS1.6 | DIS1.6
E1
  Top 0.152: IC1.E1 153.06,95.1 148.16,90.19 150.72,87.63 189.74,87.63 191.72,89.61 191.72,138.99 192.33,139.6 R57.1
E2  (1 unrouted)
E11  (via drill 0.35)  (1 unrouted)
  Top 0.152: v49.53,143.41 67.97,143.41 R84.1 | v15.7,109.58 15.24,109.12 15.24,101.8 16.61,100.43 16.61,53.19 v64.16,5.64
  Bottom 0.152: v15.7,109.58 v49.53,143.41 | v64.16,5.64 68.12,5.64 70.71,3.05 74.22,3.05 76.2,5.03 Q15.E
E12  (via drill 0.35)  (1 unrouted)
  Top 0.152: v89.15,144.47 88.54,143.87 88.54,143.56 R67.1 | v93.42,148.74 93.88,149.2 137.47,149.2 v140.51,146.15 | v164.9,131.06 167.64,131.06 173.74,124.97 v173.74,102.87
  Bottom 0.152: v93.42,148.74 v89.15,144.47 | v140.51,146.15 154.23,146.15 163.37,137.01 163.37,132.59 v164.9,131.06 | v173.74,102.87 173.74,27.13 170.99,24.38 170.99,6.86 172.67,5.18 Q7.B
E13  (via drill 0.35)  (1 unrouted)
  Top 0.152: v78.03,146.3 80.77,143.56 R73.1 | v53.19,128.93 53.19,113.84 v61.42,105.61 | v59.89,92.2 59.89,67.51 v68.28,59.13 | v68.28,56.69 68.28,48.16 v98.45,17.98
  Bottom 0.152: v78.03,146.3 68.73,146.3 54.71,132.28 54.71,130.45 v53.19,128.93 | v61.42,105.61 61.42,103.94 59.89,102.41 v59.89,92.2 | v68.28,56.69 v68.28,59.13 | v98.45,17.98 98.75,17.98 110.64,6.1 110.64,3.81 111.4,3.05 117.04,3.05 121.31,7.32 132.44,7.32 134.57,5.18 Q10.B
EN3  (via drill 0.35)
  Top 0.152: 160.02,136.85 159.26,136.09 159.26,133.04 v158.95,132.74 | 160.02,136.85 161.7,138.53 161.7,139.6 R3.2 | v166.27,124.97 165.35,124.97 IC2.12 | v96.01,146.91 96.01,143.56 R2.1 | v94.34,148.59 97.23,148.59 97.54,148.9 136.85,148.9 140.21,145.54 v151.33,145.54 | 160.02,136.85 v159.26,137.62
  Bottom 0.152: v158.95,132.74 158.95,129.39 163.37,124.97 v166.27,124.97 | v94.34,148.59 v96.01,146.91 | v159.26,137.62 v151.33,145.54
F5  (via drill 0.35)  (1 unrouted)
  Top 0.152: v164.29,139.14 165.2,138.23 188.52,138.23 190.81,135.94 R39.1 | v158.19,145.24 151.94,145.24 151.64,144.93 131.06,144.93 127.71,148.28 v98.6,148.28 | v11.73,144.78 11.28,144.32 10.36,144.32 9.6,145.09 9.6,145.39 U1.6
  Bottom 0.152: v158.19,145.24 v164.29,139.14 | v98.6,148.28 97.23,149.66 16.61,149.66 v11.73,144.78
G5  (via drill 0.35)  (1 unrouted)
  Top 0.152: v97.84,145.09 98.91,146.15 128.93,146.15 131.52,143.56 136.55,143.56 R29.1 | v92.51,137.62 91.44,136.55 91.44,135.33 88.54,132.44 88.54,132.13 R30.2
  Bottom 0.152: v97.84,145.09 92.51,139.75 v92.51,137.62
GND  (via drill 0.35)  (12 unrouted)
  Top 0.152: 157.89,90.37 158.8,90.37 159.13,87.94 | 157.89,90.37 153.92,90.37 | 153.92,90.37 150.86,90.37 IC1.R1 | 159.13,87.94 159.24,87.11 IC1.R15 165.2,89 165.81,89 | 164.49,98.3 164.49,97.99 165.68,96.8 | 165.68,96.8 165.71,96.77 165.71,97.28 | 165.81,89 184.1,89 VR1.1 | IC3.4 181.51,124.97 182.57,126.03 182.57,129.24 182.27,129.54 178.16,129.54 177.24,130.45 177.24,131.98 R27.2 177.24,132.13 v178.16,133.04 | R44.1 164.59,132.13 164.9,132.44 164.9,132.59 167.34,135.03 170.38,135.03 170.99,135.64 170.99,136.4 171.3,136.7 176.48,136.7 177.24,135.94 R43.2 177.39,135.79 v178.92,134.26 183.34,134.26 184.86,135.79 R41.2 | IC2.7 163.22,123.75 163.53,123.75 IC2.8 163.68,123.75 163.98,123.75 IC2.9 164.13,123.75 164.13,124.21 164.44,124.51 | 164.44,124.51 165.2,124.51 IC2.11 | 162.76,127.41 163.07,127.71 IC2.20 | 162.76,127.41 162.46,127.1 IC2.1 162.31,126.95 154.84,126.95 152.4,124.51 149.81,124.51 147.52,126.8 | 164.13,126.03 164.59,126.49 165.2,126.49 IC2.15 165.35,126.49 165.81,126.49 165.96,126.64 165.96,127.25 167.49,128.78 168.1,128.78 168.4,128.47 168.4,102.21 164.49,98.3 | 164.13,126.03 162.76,127.41 | 164.13,126.03 IC2.21 164.44,125.12 164.44,124.51 | C58.2 142.95,135.79 144.32,135.79 144.93,135.18 146,135.18 146.61,135.79 C55.2 146.76,135.94 147.22,135.94 148.9,137.62 149.5,137.62 150.88,136.25 | 155.45,139.6 154.23,139.6 150.88,136.25 | 155.45,139.6 160.78,139.6 R3.1 160.78,139.75 161.39,140.36 162.15,140.36 162.76,139.75 173.43,139.75 R6.1 173.58,139.6 v174.35,138.84 | 150.88,136.25 150.57,135.94 C1.2 | 155.45,139.6 155.45,135.33 153.16,133.04 153.16,132.13 R45.1 153.01,131.98 147.83,126.8 147.52,126.8
  Top 0.152: 147.52,126.8 144.47,126.8 IC4.8 144.32,126.64 143.71,126.64 143.41,126.34 143.41,115.98 148.59,110.8 148.59,102.79 153.21,98.17 IC1.A1 151.09,100.37 150.42,100.28 136.55,100.28 | 164.49,98.3 IC1.A15 | 127.71,135.94 126.95,136.7 125.88,136.7 125.12,135.94 123.9,135.94 C64.2 123.75,135.79 v123.75,134.72 | 131.52,135.94 132.74,135.94 133.5,136.7 134.57,136.7 135.33,135.94 C60.2 135.33,135.79 135.94,135.18 138.38,135.18 138.99,135.79 C59.2 | 127.71,135.94 128.93,135.94 129.69,136.7 130.76,136.7 131.52,135.94 | 127.71,135.94 C63.2 | 131.52,135.94 C62.2 | R19.1 98.3,132.13 99.82,132.13 R19.2 99.97,132.13 100.58,132.13 101.35,132.89 102.87,132.89 103.63,132.13 R18.2 | R18.2 103.78,132.13 104.7,133.04 104.7,135.79 R12.1 104.7,135.94 105.46,136.7 107.9,136.7 108.05,136.55 108.05,136.4 108.51,135.94 C71.2 | R18.2 103.78,131.98 104.85,130.91 106.53,130.91 106.98,131.37 106.98,131.52 107.44,131.98 R16.2 107.59,131.98 107.9,131.98 109.58,130.3 111.71,130.3 113.39,131.98 R5.1 | C49.2 130,143.56 129.39,144.17 128.17,144.17 127.56,143.56 C54.2 127.41,143.56 126.8,144.17 126.19,144.17 125.58,143.56 124.97,143.56 C69.2 124.82,143.56 124.51,143.87 124.51,144.02 124.36,144.17 123.14,144.17 122.53,143.56 C70.2 122.38,143.56 121.77,144.17 120.55,144.17 119.94,143.56 C50.2 | C53.2 114.91,143.56 115.37,143.56 115.98,144.17 119.18,144.17 119.79,143.56 C50.2 | 112.47,135.18 112.47,133.04 113.39,132.13 R5.1 | 112.47,135.18 112.47,135.79 C68.2 | 112.47,135.18 115.52,135.18 116.13,135.79 C67.2 116.28,135.94 117.04,136.7 119.33,136.7 | R5.2 115.06,132.13 113.54,132.13 R5.1
  Top 0.152: 119.33,136.7 119.48,136.55 119.48,136.4 119.94,135.94 C65.2 119.94,135.79 119.94,133.04 119.02,132.13 C52.2 119.02,131.98 119.02,126.95 121.61,124.36 122.99,124.36 123.6,124.97 123.9,124.97 Y1.2 123.9,125.12 123.14,125.88 123.14,131.98 D1.A 122.99,132.13 v123.75,132.89 | 119.33,136.7 119.79,137.16 119.79,143.41 C50.2 | 90.22,93.88 90.22,100.28 C44.2 | 90.22,93.88 90.22,92.81 C22.2 | 90.22,93.88 94.34,93.88 95.4,92.81 96.47,92.81 C21.2 96.62,92.81 96.62,100.28 C38.2 | 136.55,100.28 134.72,100.28 C41.2 134.57,100.28 133.96,100.28 132.59,98.91 129.69,98.91 C42.2 128.17,100.28 127.25,100.28 126.19,99.21 121.92,99.21 | 136.55,100.28 136.55,94.49 136.25,94.18 136.25,89.61 Q3.3 | C43.2 110.49,108.05 111.56,108.05 112.62,109.12 114.45,109.12 115.52,108.05 C30.2 | C19.2 108.05,93.88 106.38,93.88 105.31,92.81 102.87,92.81 C20.2 | C10.2 121.92,94.03 | 121.92,94.03 121.92,99.21 | 121.92,99.21 C48.2 | 121.92,94.03 125.88,94.03 127.1,92.81 128.17,92.81 C8.2 | C32.2 108.05,101.5 106.38,101.5 105.31,100.43 102.87,100.43 C37.2 | C9.2 35.66,100.43 36.73,100.43 37.8,101.5 39.47,101.5 C7.2 40.69,100.43 41.76,100.43 42.82,101.5 44.65,101.5 45.72,100.43 C6.2 | C29.2 57.3,91.59 55.47,91.59 54.41,92.66 52.12,92.66 C31.2 | LED2.K 86.26,106.68 86.26,102.87 83.82,100.43 C45.2 | 76.2,135.18 74.98,135.18 74.37,135.79 R53.1 | 76.2,135.18 76.81,135.79 R52.1 76.81,135.94 77.57,136.7 78.64,136.7 79.4,135.94 | 79.4,135.94 80.16,136.7 81.08,136.7 81.84,135.94 R50.1 81.99,135.79 83.52,134.26 86.72,134.26 87.02,134.57 87.02,135.79 R9.1 | 79.4,135.94 R51.1 | 77.57,99.21 77.57,100.28 C46.2
  Top 0.152: 77.57,99.21 77.57,93.88 | 77.57,93.88 77.57,92.81 C26.2 | 77.57,93.88 81.69,93.88 82.75,92.81 83.82,92.81 C23.2 | 76.2,135.18 76.2,134.42 78.33,132.28 78.33,111.56 82.3,107.59 82.3,105.77 81.53,105 80.47,105 78.79,106.68 LED3.K | L1.1 54.71,45.87 54.71,51.21 63.7,60.2 VR2.BOTTOM | VR3.BOTTOM 67.51,76.81 67.51,89.92 64.77,92.66 C28.2 | R24.2 74.22,125.73 74.22,109.73 71.17,106.68 LED4.K | 77.57,99.21 72.24,99.21 C47.2 | C4.2 55.93,100.43 57,100.43 58.06,101.5 59.89,101.5 60.96,100.43 C3.2 | Q13.E 101.65,5.03 106.83,5.03 109.12,2.74 137.31,2.74 139.6,5.03 Q10.E 141.73,3.05 175.72,3.05 177.7,5.03 Q7.E | JP1.1 JP1.3 JP1.5 JP1.7 JP1.9 JP1.11 JP1.13 30.48,29.87 21.03,39.32 LS1.- 20.88,39.47 19.81,40.54 14.17,40.54 13.11,39.47 8.23,39.47 LS2.- | U1.4 10.67,138.99 10.67,138.53 9.91,137.77 9.14,137.77 8.84,138.07 8.84,139.9 8.53,140.21 6.71,140.21 6.4,139.9 6.4,126.64 10.36,122.68 10.36,114.91 Q2.3 10.52,114.76 10.52,96.16 C40.2 13.87,92.66 10.21,89 10.21,83.82 Q4.3 10.06,83.82 2.9,76.66 2.9,63.55 GS1.HA | 157.94,95.1 157.18,94.34 IC1.F6 157.18,94.18 157.94,93.42 IC1.G7 157.94,93.57 157.18,92.81 IC1.H6 157.18,92.66 157.94,91.9 | 157.94,95.1 157.18,95.86 IC1.D6 | 157.94,95.1 IC1.E7 | IC1.K10 160.22,90.98 159.61,90.37 IC1.L9 159.46,90.37 158.85,90.98 IC1.K8 | IC1.K8 158.7,90.98 158.09,90.37 IC1.L7 157.89,90.37 | 157.94,91.9 IC1.K6 | 158.85,91.9 159.46,91.9 IC1.J9 159.61,92.05 160.22,92.66 IC1.H10 | 157.94,91.9 IC1.J7 158.09,91.9 158.7,91.9 IC1.J8 158.85,91.9 | 158.85,91.9 158.85,91.14 IC1.K8 | IC1.E9 159.61,95.1 160.38,94.34 IC1.F10 | 153.92,90.37 IC1.L2
  Top 0.152: IC1.P8 158.8,87.94 159.11,87.94 159.13,87.94 | 165.81,89 165.81,96.62 165.66,96.77 165.68,96.8
  Bottom 0.152: v178.16,133.04 178.16,133.5 v178.92,134.26 v174.35,138.84 | v123.75,134.72 v123.75,132.89 123.75,111.1 120.7,108.05 C25.2 | 102.87,101.5 102.87,104.24 100.43,106.68 U2.1 | 102.87,101.5 C37.2 | 102.87,101.5 97.69,101.5 C38.2 | C30.2 116.74,109.12 118.42,109.12 119.48,108.05 120.55,108.05 C25.2 | C15.2 134.72,109.12 133.04,109.12 131.98,108.05 130.91,108.05 C17.2 130.76,107.9 130.76,102.87 128.32,100.43 C42.2 | 114.45,99.21 112.62,99.21 111.56,100.28 109.27,100.28 C32.2 | C24.2 114.45,99.21 | 115.67,93.88 115.67,97.99 114.45,99.21 | 115.67,93.88 115.67,92.81 C16.2 | 115.67,93.88 119.79,93.88 120.85,92.81 121.92,92.81 C10.2 | 115.67,93.88 112.62,93.88 111.56,92.81 109.27,92.81 C19.2 | C48.2 121.92,105.31 120.7,106.53 120.7,107.9 C25.2 | 20.42,99.21 20.42,100.28 C13.2 20.27,100.43 19.2,101.5 17.37,101.5 16.31,100.43 15.24,100.43 C14.2 | 20.42,99.21 20.42,93.88 | 20.42,93.88 20.42,92.81 C39.2 | 20.42,93.88 24.54,93.88 25.6,92.81 26.67,92.81 C36.2 | 20.42,99.21 23.32,99.21 24.38,100.28 25.3,100.28 C12.2 25.45,100.43 26.52,101.5 28.35,101.5 29.41,100.43 30.48,100.43 | 30.48,100.43 31.55,101.5 33.38,101.5 34.44,100.43 35.51,100.43 C9.2 | 30.48,100.43 C11.2 | C35.2 33.07,92.81 35.36,92.81 36.42,93.88 38.25,93.88 39.32,92.81 C34.2 39.47,92.81 41.76,92.81 42.82,93.88 45.72,93.88 | C6.2 45.72,99.21 | 45.72,99.21 45.72,93.88 | 45.72,93.88 C33.2 | 55.93,101.5 55.93,100.43 C4.2 | 55.93,101.5 55.93,106.68 LED6.K | 51.97,100.43 50.9,100.43 C5.2 49.68,99.21 45.72,99.21 | 51.97,100.43 53.03,101.5 55.93,101.5 | 51.97,100.43 51.97,92.81 C31.2 | 78.64,101.5 78.64,106.68 LED3.K | C46.2 78.64,101.5
  Bottom 0.152: 78.64,101.5 81.69,101.5 82.75,100.43 83.82,100.43 C45.2 | DIS1.1 79.25,52.12 78.33,52.12 76.96,53.49 70.56,53.49 63.86,60.2 VR2.BOTTOM 63.86,60.35 63.86,73 67.51,76.66 VR3.BOTTOM | 68.28,93.88 67.21,92.81 64.77,92.81 C28.2 | 68.28,93.88 69.95,93.88 C27.2 | 62.18,104.24 60.96,103.02 C3.2 | 62.18,104.24 63.4,105.46 63.4,106.68 LED5.K | 62.18,104.24 65.99,100.43 C2.2 66.14,100.28 67.06,100.28 68.12,99.21 68.28,99.21 | LED4.K 71.17,106.68 71.17,100.43 C47.2 71.02,100.28 69.95,99.21 68.28,99.21 | 68.28,99.21 68.28,93.88 | C44.2 90.07,100.43 90.07,102.72 86.41,106.38 86.41,106.68 LED2.K | LS2.- 8.08,39.47 8.08,58.22 2.9,63.4 GS1.HA | JP1.1 50.6,2.74 99.21,2.74 101.5,5.03 Q13.E | 20.42,93.88 15.09,93.88 14.02,92.81 C40.2
H5  (1 unrouted)
H14  (1 unrouted)
H15  (via drill 0.35)
  Top 0.152: v165.1,92.66 164.49,92.66 IC1.H15 | v94.94,86.41 v146.3,86.41 | v90.37,90.98 89,92.35 89,100.74 91.14,102.87 v91.29,102.87 | v91.29,130.91 91.29,131.37 90.68,131.98 R22.1
  Bottom 0.152: v165.1,92.66 161.44,92.66 155.19,86.41 v146.3,86.41 | v90.37,90.98 v94.94,86.41 | v91.29,130.91 v91.29,102.87
HOLD  (via drill 0.35)
  Top 0.152: 80.31,133.2 81.08,133.96 82.75,133.96 84.58,132.13 R34.2 | 80.31,133.2 79.25,132.13 R35.1 | v72.24,141.28 72.24,143.87 69.49,146.61 9.14,146.61 8.38,145.85 8.38,145.54 U1.7 | v71.93,138.23 75.29,138.23 v76.5,137.01 | 80.31,133.2 v79.86,133.66
  Bottom 0.152: v72.24,141.28 72.24,138.53 v71.93,138.23 | v79.86,133.66 v76.5,137.01
J1  (via drill 0.35)
  Top 0.152: v145.69,95.71 149.5,91.9 153.06,91.9 IC1.J1 | v144.32,95.71 136.09,87.48 93.42,87.48 92.96,87.94 76.96,87.94 v76.35,88.54 | v74.22,90.68 74.22,91.9 73.76,92.35 v73.76,94.49 | v64.77,116.13 v72.24,108.66 | v64.77,133.96 66.6,135.79 R56.1
  Bottom 0.152: v144.32,95.71 v145.69,95.71 | v74.22,90.68 v76.35,88.54 | v73.76,94.49 73.76,104.55 72.24,106.07 v72.24,108.66 | v64.77,116.13 64.77,119.48 64.92,119.63 64.92,133.81 v64.77,133.96
J5  (1 unrouted)
J12  (1 unrouted)
K1  (via drill 0.35)
  Top 0.152: v152.3,91.14 153.06,91.14 IC1.K1 | v143.1,102.87 143.1,110.19 138.38,114.91 112.17,114.91 110.8,116.28 105,116.28 v99.52,110.8 | v74.07,137.62 70.87,137.62 69.19,135.94 R55.1
  Bottom 0.152: v152.3,91.14 152.3,94.94 144.37,102.87 v143.1,102.87 | v99.52,110.8 96.77,110.8 91.9,115.67 91.9,132.44 88.85,135.48 84.58,135.48 81.84,132.74 81.23,132.74 80.92,133.04 80.92,134.11 81.08,134.26 81.08,134.87 78.33,137.62 v74.07,137.62
K2  (1 unrouted)
K3  (1 unrouted)
K11  (1 unrouted)
K12  (1 unrouted)
K13  (1 unrouted)
L5  (1 unrouted)
L11  (via drill 0.35)  (1 unrouted)
  Top 0.152: R25.1 111.25,143.56 110.64,144.17 101.8,144.17 101.19,143.56 R33.1 101.04,143.41 99.52,141.88 v99.21,141.88 | v20.73,136.7 8.99,136.7 7.01,138.68 7.01,138.99 U1.1 | v97.99,142.34 v89.76,142.34
  Bottom 0.152: v20.73,136.7 30.02,136.7 42.37,149.05 83.06,149.05 v89.76,142.34 | v97.99,142.34 98.75,142.34 v99.21,141.88
M5  (1 unrouted)
M6  (1 unrouted)
M9  (1 unrouted)
N5  (1 unrouted)
N$1  (via drill 0.35)
  Top 0.152: v163.22,130.3 163.53,130 163.53,127.86 IC2.19 | v151.94,148.9 139.14,148.9 138.23,149.81 56.84,149.81 v54.25,147.22 | v16.92,109.88 15.85,108.81 15.85,108.05 L4.P$1
  Bottom 0.152: v163.22,130.3 165.05,130.3 165.51,130.76 165.51,133.5 163.68,135.33 163.68,137.16 v151.94,148.9 | v16.92,109.88 v54.25,147.22
N$2  (via drill 0.35)
  Top 0.152: v150.11,121.46 155.14,126.49 162.31,126.49 IC2.2 | v140.66,121.46 123.14,121.46 v119.79,124.82 | v114.91,124.82 108.51,124.82 107.59,125.73 L3.2
  Bottom 0.152: v140.66,121.46 v150.11,121.46 | v114.91,124.82 v119.79,124.82
N$3
  Top 0.152: 110.49,133.81 110.49,132.89 111.25,132.13 R14.2 | 110.49,133.81 110.49,136.55 111.86,137.92 112.47,137.92 117.2,142.65 117.2,143.41 C51.2 | 110.49,133.81 107.29,133.81 105.92,132.44 105.92,132.13 R16.1
N$4
  Top 0.152: IC2.16 165.2,127.1 165.2,129.24 163.53,130.91 155.45,130.91 150.27,125.73 L5.1
N$5  (via drill 0.35)
  Top 0.152: C41.1 130.61,101.8 119.33,101.8 112.01,94.49 103.17,94.49 101.5,92.81 100.43,92.81 C20.1 100.28,92.66 98.91,92.66 95.4,89.15 69.8,89.15 65.08,93.88 63.4,93.88 C28.1 62.18,92.81 60.81,92.81 53.34,100.28 | C35.1 30.48,96.32 34.14,99.97 34.14,100.74 | 34.14,100.74 33.38,101.5 23.93,101.5 22.86,100.43 C12.1 | v88.09,133.2 89.46,134.57 89.46,135.79 R1.1 | 34.14,100.74 34.44,100.74 35.51,101.8 45.72,101.8 47.09,100.43 47.09,99.97 47.85,99.21 52.27,99.21 53.34,100.28 | 53.34,100.28 C4.1
  Bottom 0.152: v88.09,133.2 57,102.11 57,99.97 56.24,99.21 54.41,99.21 53.34,100.28 C4.1
N$6  (via drill 0.35)
  Top 0.152: v151.64,115.67 160.93,124.97 162.31,124.97 IC2.5 | v140.66,111.71 110.49,111.71 v108.97,113.23 | v106.07,134.57 106.07,135.79 R12.2 | v85.34,137.01 84.58,136.25 84.58,135.94 R11.1
  Bottom 0.152: v151.64,115.67 144.63,115.67 v140.66,111.71 | v108.97,113.23 108.97,124.21 106.07,127.1 v106.07,134.57 105.31,135.33 97.84,135.33 96.16,137.01 v85.34,137.01
N$7
  Top 0.152: R21.2 96.01,131.98 96.01,127.1 94.03,125.12 94.03,106.68 LED1.K
N$8  (via drill 0.35)
  Top 0.152: v101.8,134.11 102.26,134.57 102.26,135.79 R15.1 102.26,135.94 v102.26,140.66 | v111.71,98.91 v111.71,102.11 | v115.06,95.56 122.22,88.39 131.98,88.39 133.04,89.46 Q3.1 | v7.62,124.51 7.62,116.28 8.23,115.67 8.38,115.67 8.84,115.21 Q2.2
  Bottom 0.152: v101.8,134.11 101.8,112.01 v111.71,102.11 | v115.06,95.56 v111.71,98.91 | v7.62,124.51 32.46,149.35 94.49,149.35 102.26,141.58 v102.26,140.66
N$9  (via drill 0.35)
  Top 0.152: v150.11,110.03 153.16,110.03 166.88,123.75 166.88,125.27 166.57,125.58 165.35,125.58 IC2.13 | v135.94,94.79 135.94,90.98 134.72,89.76 Q3.2 134.72,89.61 133.2,88.09 116.13,88.09 v110.8,93.42 | v99.82,133.2 99.82,135.79 R17.1
  Bottom 0.152: v150.11,110.03 148.9,110.03 135.94,97.08 v135.94,94.79 | v99.82,133.2 99.82,111.4 104.24,106.98 104.24,99.97 v110.8,93.42
N$10  (via drill 0.35)
  Top 0.152: v97.08,119.33 97.08,125.73 R13.2 | v93.12,115.37 79.86,102.11 21.03,102.11 v17.83,105.31 | v9.6,113.54 8.69,113.54 7.47,114.76 Q2.1
  Bottom 0.152: v93.12,115.37 v97.08,119.33 | v9.6,113.54 v17.83,105.31
N$11  (via drill 0.35)
  Top 0.152: v87.02,124.66 94.34,131.98 R21.1 | v63.25,104.39 51.66,104.39 51.36,104.7 51.36,105.61 34.29,122.68 21.95,122.68 14.17,114.91 14.17,94.03 15.09,93.12 15.09,86.26 10.21,81.38 Q4.2
  Bottom 0.152: v87.02,124.66 81.99,124.66 64.47,107.14 64.47,105.61 v63.25,104.39
N$12  (via drill 0.35)
  Top 0.152: R4.2 137.92,132.13 136.55,133.5 123.29,133.5 121.92,132.13 120.85,132.13 D1.C 120.7,131.98 120.24,131.52 v120.24,131.06 | v78.79,108.66 72.85,102.72 52.88,102.72 51.05,104.55 51.05,105.46 34.14,122.38 22.1,122.38 21.49,121.77 21.49,117.5 Q1.1 | v93.42,108.66 v87.33,108.66 | v95.56,108.66 109.12,122.22 v111.4,122.22
  Bottom 0.152: v87.33,108.66 v78.79,108.66 | v95.56,108.66 v93.42,108.66 | v120.24,131.06 v111.4,122.22
N$13
  Top 0.152: Q1.2 22.86,106.53 26.98,102.41 79.7,102.41 86.41,109.12 86.41,126.34 85.95,126.8 85.95,132.74 88.09,134.87 88.09,135.79 R9.2
N$14  (via drill 0.35)
  Top 0.152: v165.05,134.87 165.05,135.03 164.29,135.79 R48.1 | v172.67,134.87 173.58,135.79 R46.2 | v64.31,75.29 75.13,75.29 76.96,77.11 v128.47,77.11 | v173.13,114.15 173.13,124.66 v167.49,130.3
  Bottom 0.152: v172.67,134.87 167.49,134.87 | 167.49,134.87 v165.05,134.87 | v64.31,75.29 47.85,58.83 15.24,58.83 11.12,62.94 11.12,63.7 8.08,66.75 4.42,66.75 GS1.A1 | v128.47,77.11 136.09,77.11 v173.13,114.15 | 167.49,134.87 v167.49,130.3
N$15  (via drill 0.35)
  Top 0.152: v86.87,126.8 86.87,131.98 R30.1
  Bottom 0.152: v86.87,126.8 88.85,124.82 88.85,106.68 LED2.A
N$16  (via drill 0.35)
  Top 0.152: v87.02,125.73 92.2,130.91 92.2,131.98 R22.2 | v73.61,117.81 66.45,117.81 v64.31,119.94 | v47.85,119.94 38.41,119.94 20.88,137.47 8.99,137.47 8.38,138.07 8.38,138.99 U1.2
  Bottom 0.152: v87.02,125.73 81.53,125.73 v73.61,117.81 | v47.85,119.94 v64.31,119.94
N$17
  Top 0.152: R37.1 71.48,132.13 71.48,132.59 68.89,135.18 68.73,135.18 68.58,135.33 68.58,136.55 66.9,138.23 46.63,138.23 39.47,145.39 10.82,145.39 U1.5
N$18
  Top 0.152: 167.34,136.55 167.94,135.94 R47.1 | 167.34,136.55 167.18,136.7 163.68,136.7 163.37,136.4 163.37,135.64 159.87,132.13 154.38,132.13 R45.2 | 167.34,136.55 168.4,137.62 179.38,137.62 181.05,135.94 R42.2
N$19
  Top 0.152: 171.3,135.33 171.75,135.79 R46.1 | 171.3,135.33 168.1,132.13 165.81,132.13 R44.2 | 171.3,135.33 172.97,133.66 186.54,133.66 188.67,135.79 R40.2
N$20  (via drill 0.35)
  Top 0.152: v65.38,138.84 v80.31,138.84 82.75,136.4 82.75,136.25 83.06,135.94 R50.2 | v52.58,120.55 52.58,106.68 SW1.P$2 | v189.89,141.28 189.89,139.75 R58.1 | v97.69,148.13 94.79,148.13 94.64,147.98 82.3,147.98 v82.14,148.13
  Bottom 0.152: v65.38,138.84 65.38,138.38 59.28,132.28 59.28,127.25 v52.58,120.55 | v189.89,141.28 181.36,149.81 101.04,149.81 98.91,147.68 98.15,147.68 v97.69,148.13 | v82.14,148.13 85.5,144.78 85.5,144.02 v80.31,138.84
N$21
  Top 0.152: R54.2 73,135.79 73,133.81 74.52,132.28 74.52,127.25 78.03,123.75 78.03,110.34 81.23,107.14 81.23,106.68 LED3.A
N$22  (via drill 0.35)
  Top 0.152: 80.47,134.72 80.47,135.79 R51.2 | v45.11,108.05 43.74,106.68 SW2.P$2 | v141.73,146.76 186.23,146.76 189.13,143.87 189.13,142.34 187.45,140.66 187.45,139.75 R59.1 | v112.93,146.76 97.23,146.76 v96.62,146.15 | 80.47,134.72 v82.14,134.72 | 80.47,134.72 v80.47,134.57
  Bottom 0.152: v80.47,134.57 80.47,127.41 61.72,108.66 45.72,108.66 v45.11,108.05 | v112.93,146.76 v141.73,146.76 | v96.62,146.15 91.75,146.15 90.37,144.78 90.37,142.04 87.17,138.84 84.28,138.84 82.14,136.7 v82.14,134.72
N$23
  Top 0.152: R48.2 165.81,135.79 165.81,134.72 163.83,132.74 163.83,131.22 165.96,129.08 168.25,129.08 172.52,124.82 172.52,103.17 186.69,89 VR1.2 186.69,88.85 189.13,88.85 VR1.3
N$24
  Top 0.152: R55.2 70.56,135.79 70.56,134.57 72.39,132.74 72.39,128.93 74.98,126.34 74.98,107.9 73.76,106.68 LED4.A
N$25  (via drill 0.35)
  Top 0.152: v132.74,135.33 132.59,135.18 130.76,135.18 130.61,135.33 130.61,135.48 130.3,135.79 C62.1 | v136.7,128.78 139.29,126.19 139.9,126.19 IC4.2 | v32,61.11 30.33,62.79 30.33,64.16 VR2.WIPER | v120.4,83.97 v69.19,83.97
  Bottom 0.152: v132.74,135.33 132.74,132.74 v136.7,128.78 136.7,126.49 137.31,125.88 137.31,107.44 136.09,106.22 135.64,106.22 130.3,100.89 130.3,92.81 128.78,91.29 127.71,91.29 v120.4,83.97 | v32,61.11 46.33,61.11 v69.19,83.97
N$26  (via drill 0.35)
  Top 0.152: v78.03,133.5 78.03,135.79 R52.2 | 39.93,108.97 36.88,108.97 34.59,106.68 SW3.P$2 | 39.93,108.97 v44.81,108.97 | v69.19,147.22 71.48,149.5 138.07,149.5 141.43,146.15 178.31,146.15 184.71,139.75 R60.1 | 39.93,108.97 v39.93,115.67
  Bottom 0.152: v78.03,133.5 78.03,125.42 61.57,108.97 v44.81,108.97 | v69.19,147.22 54.41,132.44 54.41,131.06 39.93,116.59 v39.93,115.67
N$27
  Top 0.152: R56.2 67.97,135.79 67.97,133.35 68.58,132.74 68.58,125.12 63.7,120.24 63.7,108.97 65.99,106.68 LED5.A
N$28  (via drill 0.35)
  Top 0.152: v112.47,144.47 111.25,144.47 | 111.25,144.47 101.04,144.47 100.13,143.56 99.67,143.56 R49.2 | v110.49,115.67 102.87,108.05 U2.2 | v168.71,137.01 168.71,136.85 169.62,135.94 R47.2 | 111.25,144.47 v111.25,145.54
  Bottom 0.152: v112.47,144.47 112.47,138.38 113.23,137.62 113.23,124.97 110.49,122.22 v110.49,115.67 | v168.71,137.01 165.51,137.01 153.01,149.5 114.76,149.5 111.25,146 v111.25,145.54
N$29  (via drill 0.35)
  Top 0.152: v75.59,137.01 75.59,135.94 R53.2 | v37.64,104.24 28.19,104.24 25.76,106.68 SW4.P$2 | v76.35,144.47 76.35,146.61 77.27,147.52 128.02,147.52 130.91,144.63 175.72,144.63 180.59,139.75 182.27,139.75 R61.1
  Bottom 0.152: 75.59,132.74 75.59,132.13 76.5,131.22 76.5,124.36 61.72,109.58 42.98,109.58 v37.64,104.24 | 75.59,132.74 v75.59,137.01 | v76.35,144.47 72.54,140.66 72.54,137.01 69.19,133.66 69.19,133.04 69.49,132.74 75.59,132.74
N$30  (via drill 0.35)
  Top 0.152: v182.88,147.37 186.08,147.37 193.24,140.21 193.24,140.06 193.55,139.75 R57.2 | v142.65,111.56 142.19,111.56 138.53,115.21 112.32,115.21 110.95,116.59 104.39,116.59 v96.47,108.66 | v64.77,105 60.2,105 58.52,106.68 LED6.A
  Bottom 0.152: v182.88,147.37 182.88,132.74 184.4,131.22 184.4,129.24 165.2,110.03 151.03,110.03 149.5,111.56 v142.65,111.56 | v96.47,108.66 94.94,107.14 94.94,105.61 91.59,102.26 90.98,102.26 87.94,105.31 87.94,108.97 87.63,109.27 70.56,109.27 66.29,105 v64.77,105
N$31  (via drill 0.35)
  Top 0.152: v149.2,137.01 149.05,137.01 146.91,134.87 144.63,134.87 141.88,132.13 C66.+ | v162.46,137.01 162.92,137.01 163.83,137.92 188.21,137.92 189.74,136.4 189.74,126.49 187.76,124.51 185.93,124.51 185.78,124.66 185.78,125.42 186.84,126.49 IC3.6 187,126.49 187,127.56 IC3.7
  Bottom 0.152: v149.2,137.01 149.66,137.01 150.27,136.4 161.85,136.4 v162.46,137.01
N$33  (via drill 0.35)
  Top 0.152: v137.92,137.01 123.6,137.01 122.99,136.4 122.99,136.25 122.68,135.94 C64.1 | v150.57,133.66 152.71,135.79 R64.1 | v178.46,130.15 182.12,130.15 183.95,128.32 187.6,128.32 187.91,128.02 187.91,125.88 187.76,125.73 187.6,125.73 187,125.12 IC3.5 | v154.84,129.39 v159.87,129.39
  Bottom 0.152: v137.92,137.01 138.68,137.01 142.04,133.66 v150.57,133.66 v154.84,129.39 | v178.46,130.15 170.69,130.15 168.1,127.56 161.7,127.56 v159.87,129.39
N$34  (via drill 0.35)
  Top 0.152: v139.9,136.7 138.53,136.7 138.23,136.4 138.23,136.25 137.92,135.94 C59.1 | 162.15,135.79 v161.24,134.87 | v179.22,128.32 181.05,126.49 181.36,126.49 IC3.3 | v164.29,137.31 163.68,137.31 162.15,135.79 | 162.15,135.79 R62.2